# EAGLE schematic powerdist (EAGLE 6.5.0)
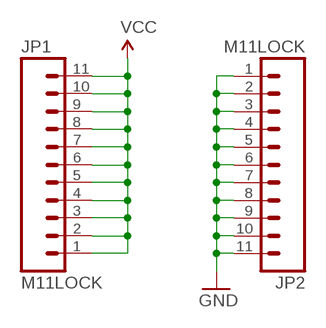
[diagram p0: schematic, sheet 1]

## Parts
JP1  M11LOCK  [1X11_LOCK]
JP2  M11LOCK  [1X11_LOCK]

## Nets
GND: JP2.1 JP2.2 JP2.3 JP2.4 JP2.5 JP2.6 JP2.7 JP2.8 JP2.9 JP2.10 JP2.11
VCC: JP1.1 JP1.2 JP1.3 JP1.4 JP1.5 JP1.6 JP1.7 JP1.8 JP1.9 JP1.10 JP1.11

## Library data of the parts
JP1 JP2 = SparkFun-Connectors:M11: Header 11 Standard 11-pin 0.1" header. Use with straight break away headers (SKU : PRT-00116), right angle break away headers (PRT-00553), swiss pins (PRT-00743), machine pins (PRT-00117), and female headers (PRT-00115).